# EAGLE design Badge_V3 (EAGLE 8.7.1)
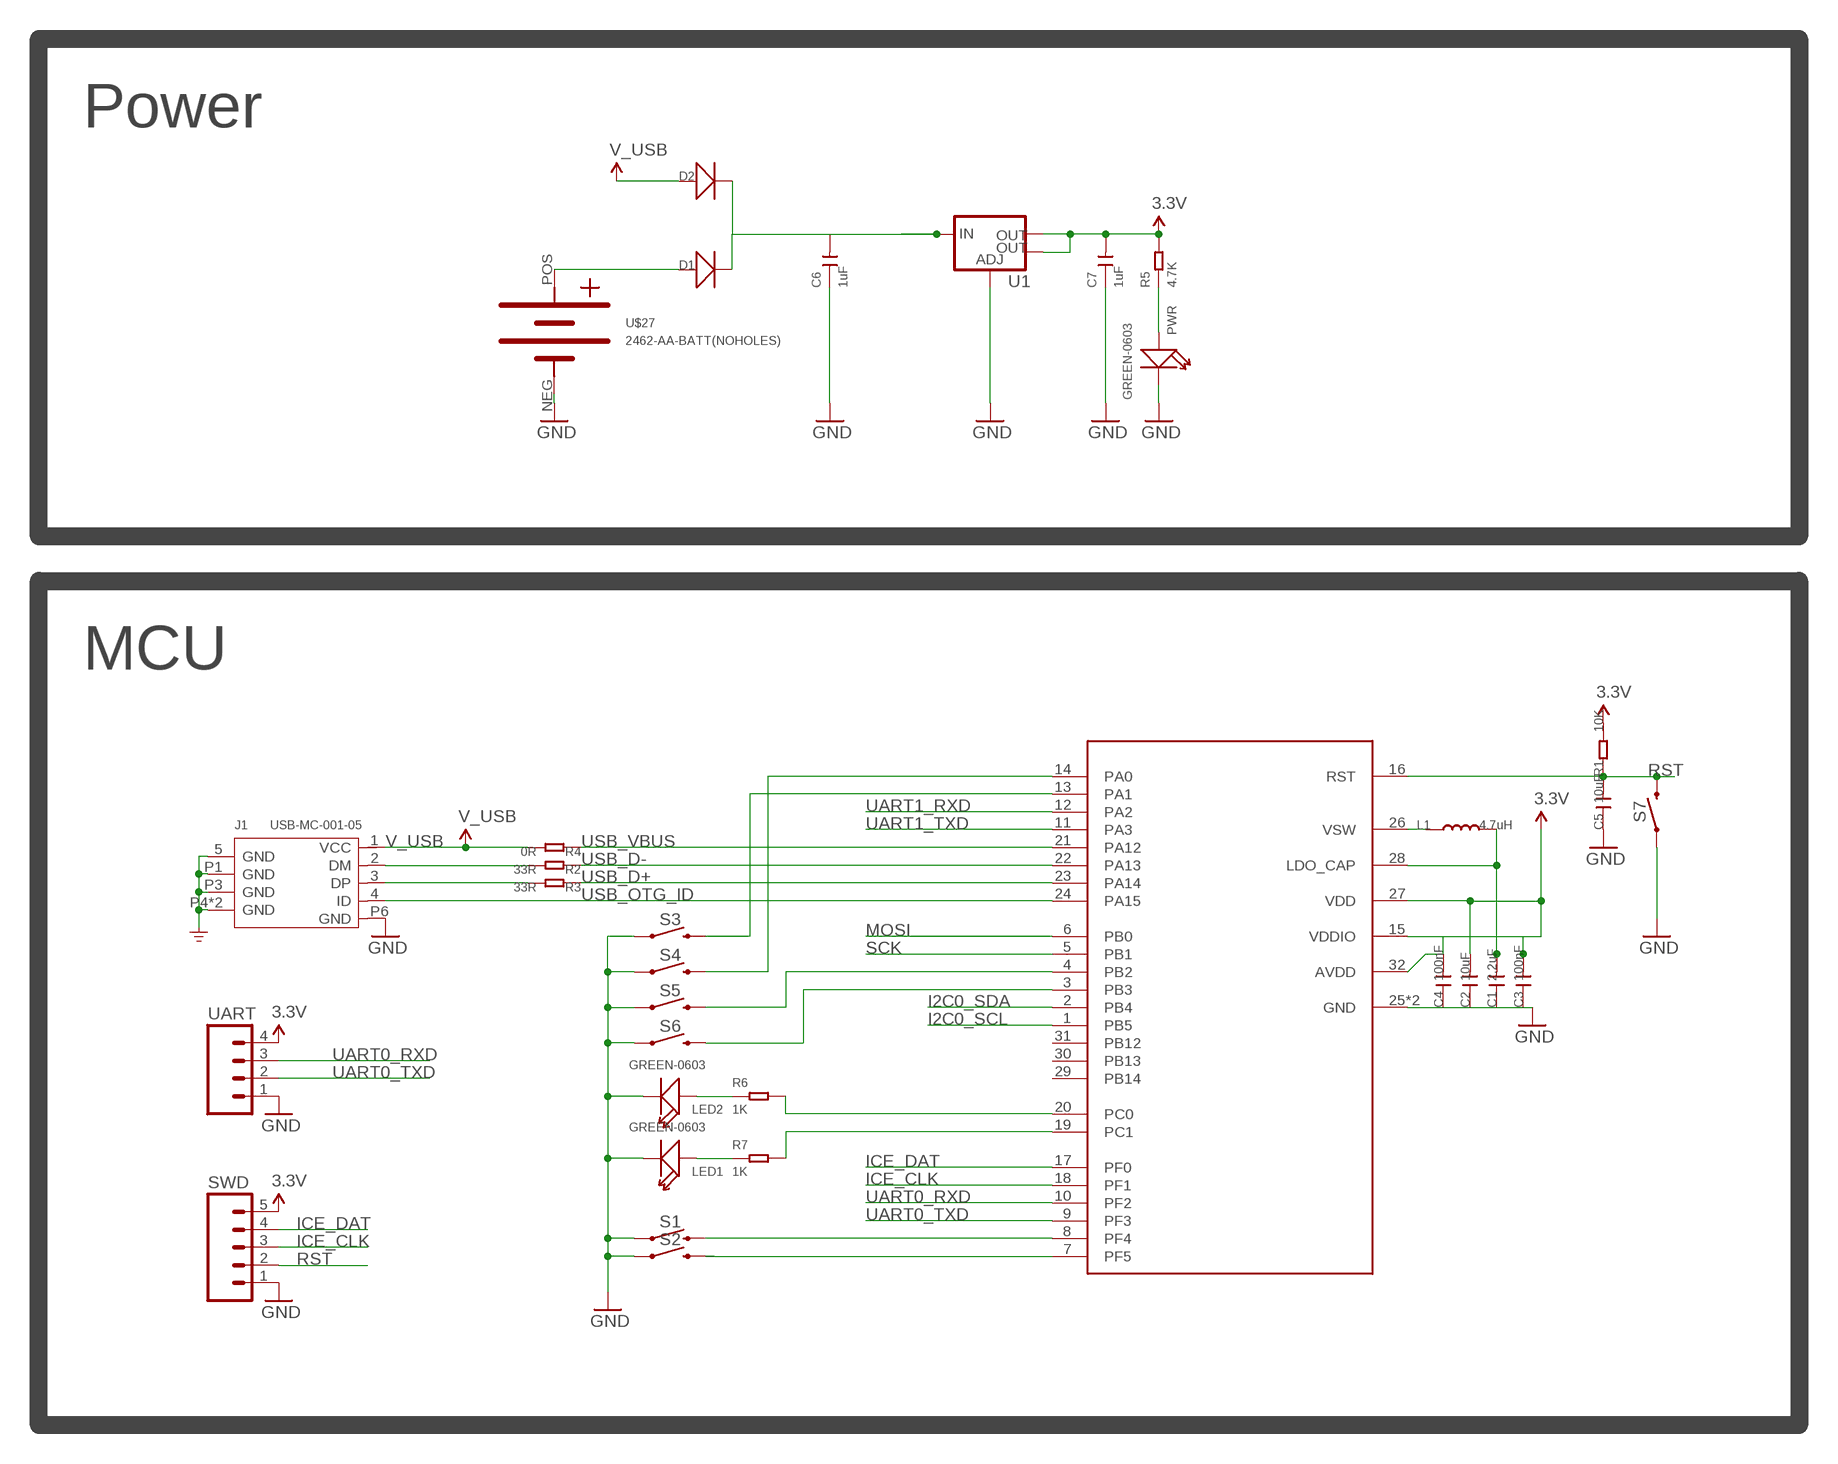
[diagram p0: schematic, sheet 1, part 1 of 2]
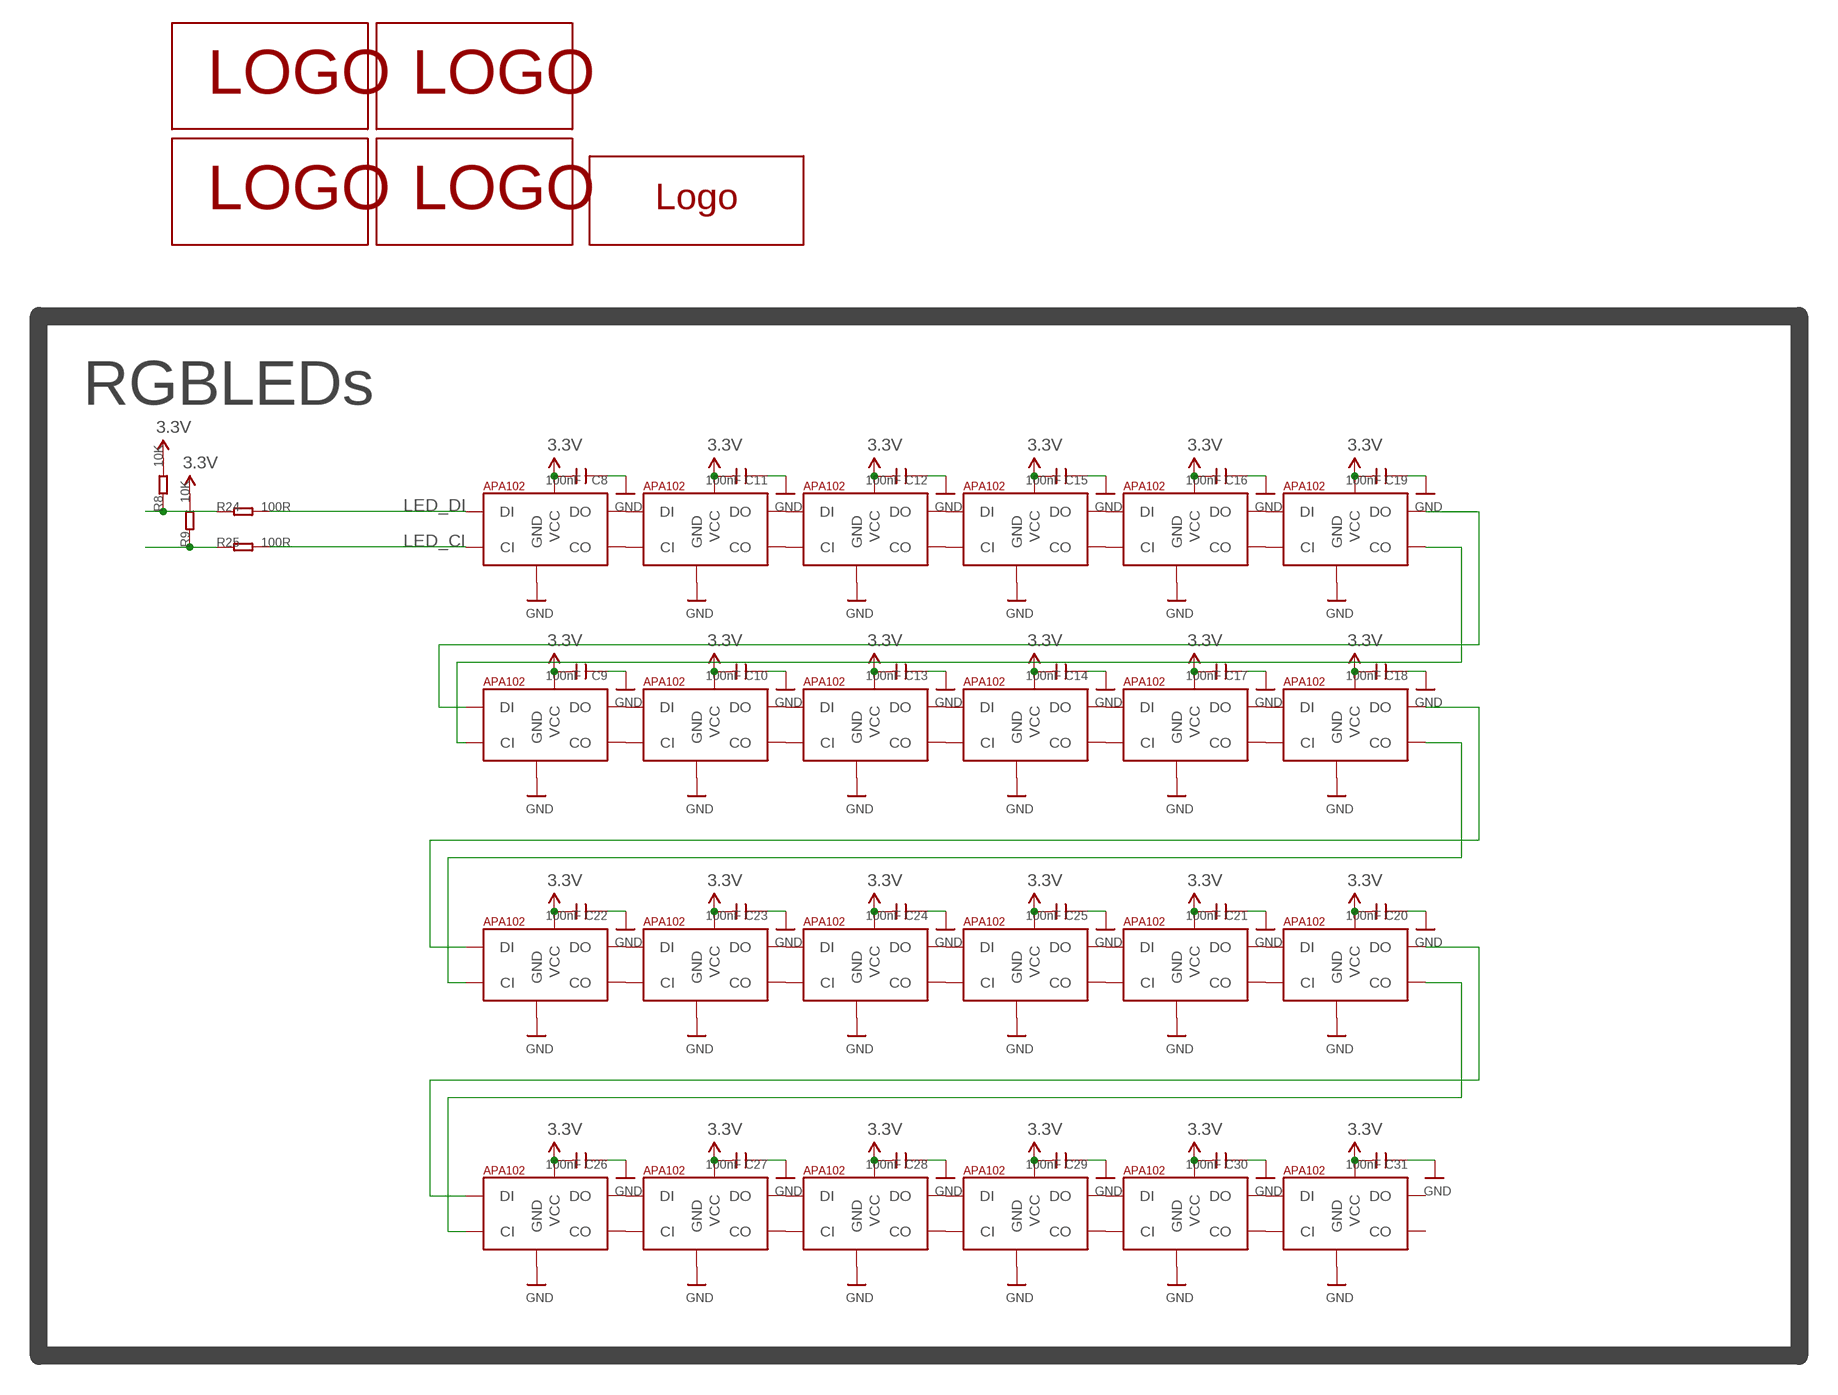
[diagram p1: schematic, sheet 1, part 2 of 2]

## Parts
C1  2.2uF  C-0402  [C0402@1]
C2  10uF  C-0402  [C0402@1]
C3  100nF  C-0603  [C0603@1]
C4  100nF  C-0402  [C0402@1]
C5  10uF  C-0402  [C0402@1]
C6  1uF  CAP-0603  [C0603]
C7  1uF  CAP-0603  [C0603]
C8  100nF  C-0402  [C0402@1]
C9  100nF  C-0402  [C0402@1]
C10  100nF  C-0402  [C0402@1]
C11  100nF  C-0402  [C0402@1]
C12  100nF  C-0402  [C0402@1]
C13  100nF  C-0402  [C0402@1]
C14  100nF  C-0402  [C0402@1]
C15  100nF  C-0402  [C0402@1]
C16  100nF  C-0402  [C0402@1]
C17  100nF  C-0402  [C0402@1]
C18  100nF  C-0402  [C0402@1]
C19  100nF  C-0402  [C0402@1]
C20  100nF  C-0402  [C0402@1]
C21  100nF  C-0402  [C0402@1]
C22  100nF  C-0402  [C0402@1]
C23  100nF  C-0402  [C0402@1]
C24  100nF  C-0402  [C0402@1]
C25  100nF  C-0402  [C0402@1]
C26  100nF  C-0402  [C0402@1]
C27  100nF  C-0402  [C0402@1]
C28  100nF  C-0402  [C0402@1]
C29  100nF  C-0402  [C0402@1]
C30  100nF  C-0402  [C0402@1]
C31  100nF  C-0402  [C0402@1]
D1  D'1206'  [SOD123]
D2  D'1206'  [SOD123]
J1  USB-MC-001-05  MICRO-USB5+4P  [MICRO-USB5+5P-SMD-0.65-7.2X5.06MM]
L1  4.7uH  L'0603'  [L0603]
LED1  GREEN-0603  SMD-LED-CLEAR-GREEN(0603)  [LED-0603]
LED2  GREEN-0603  SMD-LED-CLEAR-GREEN(0603)  [LED-0603]
PWR  GREEN-0603  SMD-LED-CLEAR-GREEN(0603)  [LED-0603]
R1  10K  R-0402  [R0402]
R2  33R  R-0402  [R0402]
R3  33R  R-0402  [R0402]
R4  0R  R-0402  [R0402]
R5  4.7K  RES-0402  [R0402]
R6  1K  RES-0402  [R0402]
R7  1K  RES-0402  [R0402]
R8  10K  R-0402  [R0402]
R9  10K  R-0402  [R0402]
R24  100R  R-0402  [R0402]
R25  100R  R-0402  [R0402]
S1  MOMENTARY-SWITCH-SPST-SMD-6.2MM-TALL  [TACTILE_SWITCH_SMD_6.2MM_TALL]
S2  MOMENTARY-SWITCH-SPST-SMD-6.2MM-TALL  [TACTILE_SWITCH_SMD_6.2MM_TALL]
S3  MOMENTARY-SWITCH-SPST-SMD-6.2MM-TALL  [TACTILE_SWITCH_SMD_6.2MM_TALL]
S4  MOMENTARY-SWITCH-SPST-SMD-6.2MM-TALL  [TACTILE_SWITCH_SMD_6.2MM_TALL]
S5  MOMENTARY-SWITCH-SPST-SMD-6.2MM-TALL  [TACTILE_SWITCH_SMD_6.2MM_TALL]
S6  MOMENTARY-SWITCH-SPST-SMD-6.2MM-TALL  [TACTILE_SWITCH_SMD_6.2MM_TALL]
S7  MOMENTARY-SWITCH-SPST-SMD-6.2MM-TALL  [TACTILE_SWITCH_SMD_6.2MM_TALL]
SWD  M05LOCK  [1X05_LOCK]
U1  V_REG_LM1117SOT223  [SOT223]
U$1  M2351  [QFN-32]
U$2  APA1022020  [APA102_2020]
U$4  APA1022020  [APA102_2020]
U$5  APA1022020  [APA102_2020]
U$6  APA1022020  [APA102_2020]
U$7  APA1022020  [APA102_2020]
U$8  APA1022020  [APA102_2020]
U$9  APA1022020  [APA102_2020]
U$10  APA1022020  [APA102_2020]
U$11  APA1022020  [APA102_2020]
U$12  APA1022020  [APA102_2020]
U$13  APA1022020  [APA102_2020]
U$14  APA1022020  [APA102_2020]
U$15  APA1022020  [APA102_2020]
U$16  APA1022020  [APA102_2020]
U$17  APA1022020  [APA102_2020]
U$18  APA1022020  [APA102_2020]
U$19  APA1022020  [APA102_2020]
U$20  APA1022020  [APA102_2020]
U$21  APA1022020  [APA102_2020]
U$22  APA1022020  [APA102_2020]
U$23  APA1022020  [APA102_2020]
U$24  APA1022020  [APA102_2020]
U$25  APA1022020  [APA102_2020]
U$26  TAIWANSILK_FILL  [TAIWAN_SILK_FILL]
U$27  2462-AA-BATT(NOHOLES)  [2462-AA-BATT-NOHOLES]
U$28  HITCON_LOGOGOLD_LARGE  [HITCON_LOGO_BIGGER_GOLD]
U$30  TAIWANKIM  [TAIWAN_SILK_FILL_2]
U$31  TAIWANMAZ  [TAIWAN_SILK_FILL_4]
U$33  APA1022020  [APA102_2020]
U$34  TAIWANPUN  [TAIWAN_SILK_FILL_3]
UART  M04LOCK  [1X04_LOCK]

## Nets
3.3V: C2.2 C3.2 C4.2 C7.2 C8.2 C9.2 C10.2 C11.2 C12.2 C13.2 C14.2 C15.2 C16.2 C17.2 C18.2 C19.2 C20.2 C21.2 C22.2 C23.2 C24.2 C25.2 C26.2 C27.2 C28.2 C29.2 C30.2 C31.2 R1.2 R5.2 R8.2 R9.2 SWD.5 U1.2(OUT) U1.4(OUT) U$1.15(VDDIO) U$1.27(VDD) U$1.32(AVDD) U$2.V_CC(VCC) U$4.V_CC(VCC) U$5.V_CC(VCC) U$6.V_CC(VCC) U$7.V_CC(VCC) U$8.V_CC(VCC) U$9.V_CC(VCC) U$10.V_CC(VCC) U$11.V_CC(VCC) U$12.V_CC(VCC) U$13.V_CC(VCC) U$14.V_CC(VCC) U$15.V_CC(VCC) U$16.V_CC(VCC) U$17.V_CC(VCC) U$18.V_CC(VCC) U$19.V_CC(VCC) U$20.V_CC(VCC) U$21.V_CC(VCC) U$22.V_CC(VCC) U$23.V_CC(VCC) U$24.V_CC(VCC) U$25.V_CC(VCC) U$33.V_CC(VCC) UART.4
GND: C1.1 C2.1 C3.1 C4.1 C5.1 C6.1 C7.1 C8.1 C9.1 C10.1 C11.1 C12.1 C13.1 C14.1 C15.1 C16.1 C17.1 C18.1 C19.1 C20.1 C21.1 C22.1 C23.1 C24.1 C25.1 C26.1 C27.1 C28.1 C29.1 C30.1 C31.1 J1.5(GND) J1.P1(GND) J1.P3(GND) J1.P4(GND) J1.P5(GND) J1.P6(GND) LED1.- LED2.- PWR.- S1.A2 S2.A2 S3.A2 S4.A2 S5.A2 S6.A2 S7.A2 SWD.1 U1.1(ADJ) U$1.25(GND) U$1.EP(GND) U$2.GND U$4.GND U$5.GND U$6.GND U$7.GND U$8.GND U$9.GND U$10.GND U$11.GND U$12.GND U$13.GND U$14.GND U$15.GND U$16.GND U$17.GND U$18.GND U$19.GND U$20.GND U$21.GND U$22.GND U$23.GND U$24.GND U$25.GND U$27.NEG U$33.GND UART.1 ; supply symbol labelled GND_POWER
I2C0_SCL: U$1.1(PB5)
I2C0_SDA: U$1.2(PB4)
ICE_CLK: SWD.3 U$1.18(PF1)
ICE_DAT: SWD.4 U$1.17(PF0)
LED_CI: R25.2 U$33.C_IN(CI)
LED_DI: R24.2 U$33.D_IN(DI)
MOSI: R8.1 R24.1 U$1.6(PB0)
N$1: L1.1 U$1.26(VSW)
N$2: C1.2 L1.2 U$1.28(LDO_CAP)
N$3: J1.2(DM) R2.2
N$4: J1.3(DP) R3.2
N$5: R6.2 U$1.20(PC0)
N$6: C6.2 D1.- D2.- U1.3(IN)
N$7: PWR.+ R5.1
N$8: D1.+ U$27.POS
N$9: S1.B2 U$1.8(PF4)
N$10: S2.B2 U$1.7(PF5)
N$11: S4.B2 U$1.14(PA0)
N$12: LED2.+ R6.1
N$13: LED1.+ R7.1
N$14: R7.2 U$1.19(PC1)
N$15: S3.B2 U$1.13(PA1)
N$16: S5.B2 U$1.4(PB2)
N$18: S6.B2 U$1.3(PB3)
N$22: U$2.D_OUT(DO) U$4.D_IN(DI)
N$23: U$2.CL_OUT(CO) U$4.C_IN(CI)
N$24: U$4.CL_OUT(CO) U$5.C_IN(CI)
N$25: U$4.D_OUT(DO) U$5.D_IN(DI)
N$26: U$5.D_OUT(DO) U$6.D_IN(DI)
N$27: U$5.CL_OUT(CO) U$6.C_IN(CI)
N$28: U$6.CL_OUT(CO) U$7.C_IN(CI)
N$29: U$6.D_OUT(DO) U$7.D_IN(DI)
N$30: U$8.D_OUT(DO) U$9.D_IN(DI)
N$31: U$8.CL_OUT(CO) U$9.C_IN(CI)
N$32: U$9.CL_OUT(CO) U$10.C_IN(CI)
N$33: U$9.D_OUT(DO) U$10.D_IN(DI)
N$34: U$10.D_OUT(DO) U$11.D_IN(DI)
N$35: U$10.CL_OUT(CO) U$11.C_IN(CI)
N$36: U$11.CL_OUT(CO) U$12.C_IN(CI)
N$37: U$11.D_OUT(DO) U$12.D_IN(DI)
N$38: U$12.D_OUT(DO) U$13.D_IN(DI)
N$39: U$12.CL_OUT(CO) U$13.C_IN(CI)
N$40: U$14.CL_OUT(CO) U$15.C_IN(CI)
N$41: U$14.D_OUT(DO) U$15.D_IN(DI)
N$42: U$15.D_OUT(DO) U$16.D_IN(DI)
N$43: U$15.CL_OUT(CO) U$16.C_IN(CI)
N$44: U$16.CL_OUT(CO) U$17.C_IN(CI)
N$45: U$16.D_OUT(DO) U$17.D_IN(DI)
N$46: U$17.D_OUT(DO) U$18.D_IN(DI)
N$47: U$17.CL_OUT(CO) U$18.C_IN(CI)
N$48: U$18.CL_OUT(CO) U$19.C_IN(CI)
N$49: U$18.D_OUT(DO) U$19.D_IN(DI)
N$50: U$2.C_IN(CI) U$33.CL_OUT(CO)
N$51: U$2.D_IN(DI) U$33.D_OUT(DO)
N$52: U$20.D_OUT(DO) U$21.D_IN(DI)
N$53: U$20.CL_OUT(CO) U$21.C_IN(CI)
N$66: U$21.D_OUT(DO) U$22.D_IN(DI)
N$67: U$21.CL_OUT(CO) U$22.C_IN(CI)
N$80: U$22.D_OUT(DO) U$23.D_IN(DI)
N$81: U$22.CL_OUT(CO) U$23.C_IN(CI)
N$94: U$23.D_OUT(DO) U$24.D_IN(DI)
N$95: U$23.CL_OUT(CO) U$24.C_IN(CI)
N$108: U$24.D_OUT(DO) U$25.D_IN(DI)
N$109: U$24.CL_OUT(CO) U$25.C_IN(CI)
N$122: U$7.D_OUT(DO) U$8.D_IN(DI)
N$123: U$7.CL_OUT(CO) U$8.C_IN(CI)
N$124: U$13.D_OUT(DO) U$14.D_IN(DI)
N$125: U$13.CL_OUT(CO) U$14.C_IN(CI)
N$126: U$19.D_OUT(DO) U$20.D_IN(DI)
N$127: U$19.CL_OUT(CO) U$20.C_IN(CI)
RST: C5.2 R1.1 S7.B2 SWD.2 U$1.16(RST)
SCK: R9.1 R25.1 U$1.5(PB1)
UART0_RXD: U$1.10(PF2) UART.3
UART0_TXD: U$1.9(PF3) UART.2
UART1_RXD: U$1.12(PA2)
UART1_TXD: U$1.11(PA3)
USB_D+: R3.1 U$1.23(PA14)
USB_D-: R2.1 U$1.22(PA13)
USB_OTG_ID: J1.4(ID) U$1.24(PA15)
USB_VBUS: R4.1 U$1.21(PA12)
V_USB: D2.+ J1.1(VCC) R4.2
Unconnected: U$1.29(PB14) U$1.30(PB13) U$1.31(PB12) U$25.CL_OUT(CO) U$25.D_OUT(DO)

## Notes on the sheet
- Power
- RGBLEDs
- MCU

## Library data of the parts
C1-C5 C8-C31 = Discrete:C*: Ceramic Capacitors
C6 C7 = Discrete:CAP: Ceramic Capacitors
D1 D2 = Discrete:D*
J1 = Connector-new:MICRO-USB5+4P: 5+4P-SMD-0.65-B:320010000;5+2P-SMD-0.65-AB:340032001;5+5P-SMD-0.65-7.2X5.06MM:320010050;
L1 = Discrete:L*
LED1 LED2 PWR = Seeed-OPL-Diode:SMD-LED-CLEAR-GREEN(0603): 304090043; MPN: 19-217-G7C-AN1P2-3T
R1-R4 R8 R9 R24 R25 = Discrete:R*
R5-R7 = Seeed-OPL-Resistor:RES
S1-S7 = SparkFun-Switches:MOMENTARY-SWITCH-SPST: Momentary Switch (Pushbutton) - SPST Normally-open (NO) SPST momentary switches (buttons, pushbuttons). Variants PTH-12MM - 12mm square, through-hole Momentary Pushbutton Switch - 12mm Square <https://www.sparkfun.com/products/9190> (COM-09190) PTH-6.0MM, PTH-6.0MM-KIT - 6.0mm square, through-hole Mini Pushbutton Switch <https://www.sparkfun.com/products/97> (COM-00097) KIT package intended for soldering kit's - only one side of pads' copper is exposed. PTH-RIGHT-ANGLE-KIT - Right-angle, through-hole Right Angle Tactile Button <https://www.sparkfun.com/products/10791> - Used on SparkFun BigTime Watch Kit <https://www.sparkfun.com/products/11734> SMD-12MM - 12mm square, surface-mount Tactile Button - SMD (12mm) <https://www.sparkfun.com/products/12993> (COM-12993) Used on SparkFun PicoBoard <https://www.sparkfun.com/products/11888> SMD-4.5MM - 4.5mm Square Trackball Switch Used on SparkFun Blackberry Trackballer Breakout <https://www.sparkfun.com/products/13169> SMD-4.6MMX2.8MM - 4.60mm x 2.80mm, surface mount Used on SparkFun SAMD21 Mini Breakout <https://www.sparkfun.com/products/13664> SMD-5.2MM, SMD-5.2-REDUNDANT - 5.2mm square, surface-mount Mini Pushbutton Switch - SMD <https://www.sparkfun.com/products/8720> (COM-08720) Used on Arduino Pro Mini <https://www.sparkfun.com/products/11114> REDUNDANT package connects both switch circuits together SMD-6.0X3.5MM - 6.0 x 3.5mm, surface mount Momentary Reset Switch SMD <https://www.sparkfun.com/products/8229> (COM-08229) SMD-6.2MM-TALL - 6.2mm square, surface mount Tactile Button - SMD (6mm) <https://www.sparkfun.com/products/12992> Used on SparkFun Digital Sandbox <https://www.sparkfun.com/products/12651> SMD-RIGHT-ANGLE - Right-angle, surface mount Used on SparkFun Block for Intel® Edison - Arduino <https://www.sparkfun.com/products/13036>; PROD_ID: SWCH-11966; SF_SKU: COM-12992
SWD = SparkFun-Connectors:M05: Header 5 Standard 5-pin 0.1" header. Use with straight break away headers (SKU : PRT-00116), right angle break away headers (PRT-00553), swiss pins (PRT-00743), machine pins (PRT-00117), and female headers (PRT-00115). Molex polarized connector foot print use with SKU : PRT-08230 with associated crimp pins and housings.
U1 = SparkFun-IC-Power:V_REG_LM1117: Voltage Regulator LM1117 Standard adjustable voltage regulator but in SMD form. Spark Fun Electronics SKU : COM-00595; PROD_ID: VREG-08170
U$1 = SparkFun-IC-Microcontroller:M2351
U$2 U$4-U$25 U$33 = jos-ph:APA102: APA102C 5050 RGB LED -- Adafruit DotStar Single LED Pixel Product Page: https://www.adafruit.com/products/2343 Datasheet: https://cdn-shop.adafruit.com/product-files/2343/APA102C.pdf
U$26 U$30 U$31 U$34 = logo:TAIWAN
U$27 = 2462-AA-BATT:2462-AA-BATT
U$28 = logo:HITCON_LOGO
UART = SparkFun-Connectors:M04: Header 4 Standard 4-pin 0.1" header. Use with straight break away headers (SKU : PRT-00116), right angle break away headers (PRT-00553), swiss pins (PRT-00743), machine pins (PRT-00117), and female headers (PRT-00115). Molex polarized connector foot print use with SKU : PRT-08231 with associated crimp pins and housings. 1MM SMD Version SKU: PRT-10208; PROD_ID: CONN-09696

## Net classes
0 default: width 0.254 mm

## Board
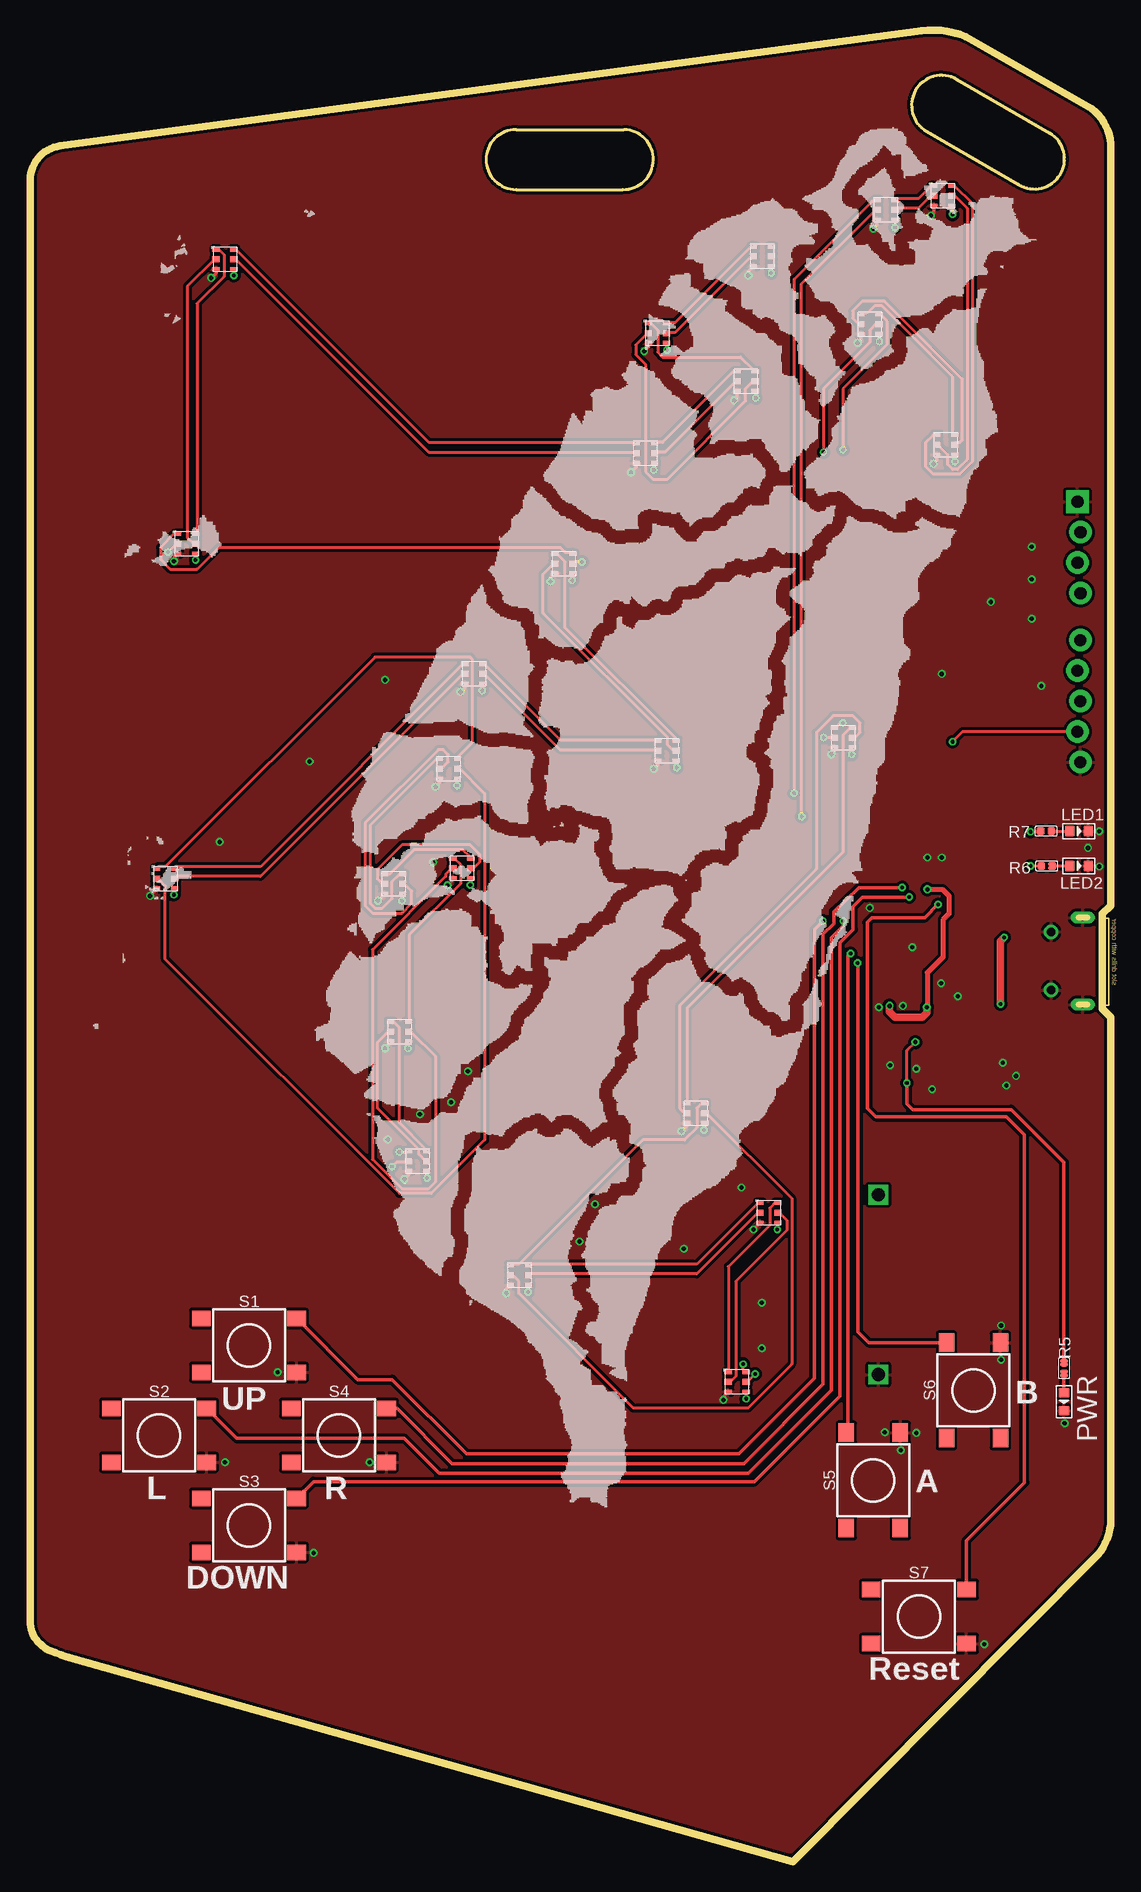
[diagram p2: board, top side]
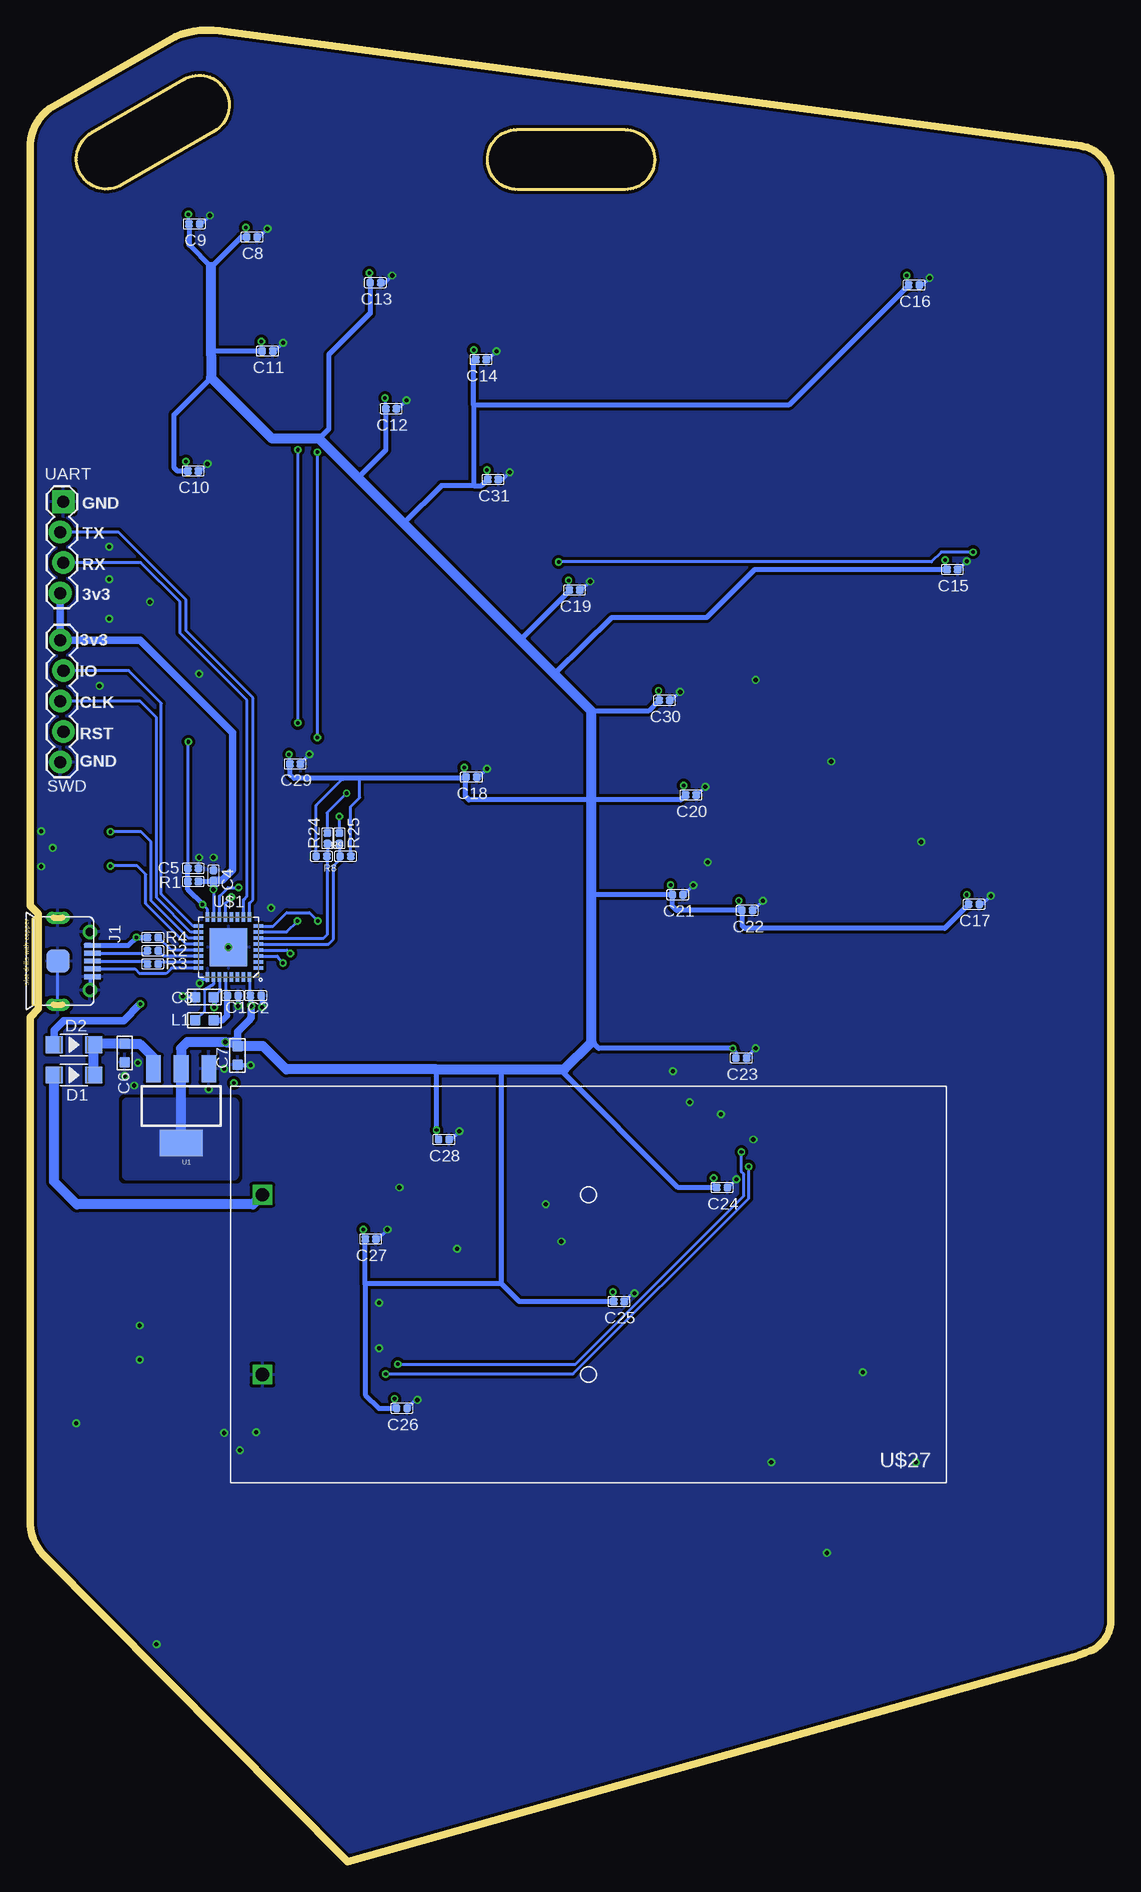
[diagram p3: board, bottom side, seen from below]

Size 90.11 x 152.66 mm. Coordinates in mm from the lower left corner, seen from the top.
Outline: 0.01,139.9 0.01,20.1 arc68 1.71,17.6 arc1 3.01,17.1 63.61,0 89.01,25.6 arc42 90.11,28.5 90.11,70.4 89.41,71.1 89.41,79 90.11,79.7 90.11,142.8 arc53 88.51,146.1 78.01,152.1 arc31 74.31,152.6 2.51,143 arc86 0.01,139.9
Outline: 40.52,144.37 49.52,144.37 arc-180 49.42,139.37 40.52,139.37 arc-180 40.52,144.37
Outline: 77.25,148.55 85.04,144.05 arc-180 82.45,139.77 74.75,144.22 arc-180 77.25,148.55
Copper layers (1*16): Top 0.035mm / dielectric 1.5mm / Bottom 0.035mm
Design rules "SeeedStudio_2layer_DRU_no_angle_20140221 *": minimum track width 6mil, minimum drill 0.3mm, track to track 6mil, track to pad 6mil, pad to pad 6mil, via to via 6mil, smd to smd 0mil, copper to edge 10mil, drill to drill 10mil, minimum pad ring 10mil, minimum via ring 6mil, stop-mask expansion 2mil, vias tented up to drill 100mil, thermal gap 10mil

### Footprints (pad centres in the part's own frame; a part is rotated, then mirrored left to right if it is on the bottom)
C0402@1 = smd 0.635 x 0.635: 1 -0.445,0; 2 0.445,0
C0603@1 = smd 0.889 x 0.889: 1 -0.762,0; 2 0.762,0
C0603 = smd 0.889 x 0.889: 1 -0.762,0; 2 0.762,0
SOD123 = smd 1.397 x 1.397: + -1.651,0; - 1.651,0
MICRO-USB5+5P-SMD-0.65-7.2X5.06MM = smd 0.4 x 1.35: 1 -1.3,2.875; 2 -0.65,2.875; 3 0,2.875; 4 0.65,2.875; 5 1.3,2.875 | smd 1.9 x 1.9: P1 0,0 | drill 0.508 pad 1.016 long: P3 -3.625,0; P4 3.625,0 | drill 0.7: P5 -2.425,2.65; P6 2.425,2.65
L0603 = smd 0.889 x 0.889: 1 -0.762,0; 2 0.762,0
LED-0603 = smd 0.762 x 0.889: + -0.762,0; - 0.762,0
R0402 = smd 0.635 x 0.635: 1 -0.445,0; 2 0.445,0
R0402' = smd 0.635 x 0.635: 1 0,0.445; 2 0,-0.445
TACTILE_SWITCH_SMD_6.2MM_TALL = smd 1.55 x 1.3: A1 -3.975,-2.25; A2 3.975,-2.25; B1 -3.975,2.25; B2 3.975,2.25
1X05_LOCK = drill 1.016 pad 1.88: 1 0,0.127; 2 2.54,-0.127; 3 5.08,0.127; 4 7.62,-0.127; 5 10.16,0.127
SOT223 = smd 1.219 x 2.235: 1 -2.311,-3.099; 2 0,-3.099; 3 2.311,-3.099 | smd 3.6 x 2.2: 4 0,3.099
QFN-32 = smd 0.285 x 0.8: 1 -1.75,-2.5; 2 -1.25,-2.5; 3 -0.75,-2.5; 4 -0.25,-2.5; 5 0.25,-2.5; 6 0.75,-2.5; 7 1.25,-2.5; 8 1.75,-2.5; 17 1.75,2.5; 18 1.25,2.5; 19 0.75,2.5; 20 0.25,2.5; 21 -0.25,2.5; 22 -0.75,2.5; 23 -1.25,2.5; 24 -1.75,2.5 | smd 0.8 x 0.285: 9 2.5,-1.75; 10 2.5,-1.25; 11 2.5,-0.75; 12 2.5,-0.25; 13 2.5,0.25; 14 2.5,0.75; 15 2.5,1.25; 16 2.5,1.75; 25 -2.5,1.75; 26 -2.5,1.25; 27 -2.5,0.75; 28 -2.5,0.25; 29 -2.5,-0.25; 30 -2.5,-0.75; 31 -2.5,-1.25; 32 -2.5,-1.75 | smd 3.15 x 3.15: EP 0,0
APA102_2020 = smd 0.6 x 0.5: C_IN -0.75,0; CL_OUT 0.75,0 | smd 0.6 x 0.35: D_IN -0.75,0.825; D_OUT 0.75,0.825; GND -0.75,-0.825; V_CC 0.75,-0.825
2462-AA-BATT-NOHOLES = drill 1.1 square: NEG 57.023,-9.017; POS 57.023,-24.003
1X04_LOCK = drill 1.016 pad 1.88 square: 1 0,0.127 | drill 1.016 pad 1.88: 2 2.54,-0.127; 3 5.08,0.127; 4 7.62,-0.127

### Placement (x,y rotation side)
C1  73.19,72.19 180 bottom
C2  71.28,72.19 180 bottom
C3  75.55,72.07 0 bottom
C4  74.81,82.2 270 bottom
C5  76.51,82.8 180 bottom
C6  82.21,67.4 90 bottom
C7  72.81,67.2 90 bottom
C8  71.61,135.4 180 bottom
C9  76.41,136.5 180 bottom
C10  76.51,115.9 180 bottom
C11  70.31,125.9 180 bottom
C12  60.01,121.1 180 bottom
C13  61.31,131.6 180 bottom
C14  52.51,125.2 180 bottom
C15  13.21,107.7 180 bottom
C16  16.41,131.4 180 bottom
C17  11.41,79.8 180 bottom
C18  53.31,90.4 180 bottom
C19  44.71,106 180 bottom
C20  35.01,88.9 180 bottom
C21  36.11,80.6 180 bottom
C22  30.31,79.3 180 bottom
C23  30.81,67 180 bottom
C24  32.41,56.2 180 bottom
C25  41.01,46.7 180 bottom
C26  59.11,37.8 180 bottom
C27  61.71,51.9 180 bottom
C28  55.61,60.2 180 bottom
C29  68.01,91.5 180 bottom
C30  37.21,96.8 180 bottom
C31  51.51,115.2 180 bottom
D1  86.44,65.57 0 bottom
D2  86.44,68.09 0 bottom
J1  87.78,75.07 270 bottom
L1  75.56,70.13 0 bottom
LED1  87.46,85.9 0 top
LED2  87.46,83 0 top
PWR  86.21,38.35 270 top
R1  76.51,81.7 0 bottom
R2  79.86,75.93 180 bottom
R3  79.86,74.83 180 bottom
R4  79.86,77.03 180 bottom
R5  4.7K  [R0402']  86.21,41.15 180 top
R6  1K  [R0402']  84.76,83 270 top
R7  1K  [R0402']  84.71,85.9 270 top
R8  65.81,83.8 180 bottom
R9  63.81,83.8 0 bottom
R24  65.31,85.3 90 bottom
R25  64.31,85.3 90 bottom
S1  18.26,43.05 0 top
S2  10.76,35.55 0 top
S3  18.26,28.05 0 top
S4  25.76,35.55 0 top
S5  70.31,31.8 90 top
S6  78.66,39.3 90 top
S7  74.11,20.45 0 top
SWD  87.45,91.65 90 bottom
U1  77.51,63 180 bottom
U$1  73.56,76.23 90 bottom
U$2  76.1,138.84 0 top
U$4  76.36,118.1 0 top
U$5  70.03,128.16 0 top
U$6  67.81,93.7 0 top
U$7  55.51,62.4 0 top
U$8  40.81,48.9 0 top
U$9  61.61,54.1 0 top
U$10  58.96,40 0 top
U$11  32.31,58.4 0 top
U$12  30.81,69.2 0 top
U$13  36.01,82.8 0 top
U$14  30.31,81.5 0 top
U$15  34.91,91.1 0 top
U$16  11.31,81.95 0 top
U$17  37.01,99 0 top
U$18  53.11,92.6 0 top
U$19  44.51,108.2 0 top
U$20  13.06,109.85 0 top
U$21  16.26,133.55 0 top
U$22  51.31,117.4 0 top
U$23  59.71,123.4 0 top
U$24  52.31,127.4 0 top
U$25  61.06,133.8 0 top
U$26  -2.04,23.05 0 top
U$27  13.71,31.6 180 bottom
U$28  29.92,10.09 345 top
U$30  4.36,103.6 0 top
U$31  8.56,126.7 0 top
U$33  71.37,137.67 0 top
U$34  2.16,65.15 0 top
UART  87.46,113.35 270 bottom

### Tracks (layer width: path | path; a pad name or v marks a point on that pad's centre or on a via)
3.3V  (via drill 0.3, 0.35)
  Top 0.254: 74.69,81.16 v74.81,81.04 74.69,81.1 | 87.49,105.75 UART.4 | U$2.V_CC 76.85,137.36 v76.91,137.3 | U$33.V_CC 72.12,136.21 v72.11,136.2 | U$25.V_CC v61.81,132.4 | U$5.V_CC 70.78,126.72 v70.81,126.7 | U$4.V_CC v77.11,116.7 | U$23.V_CC 60.46,122.05 v60.51,122 | U$24.V_CC 53.06,126.05 v53.11,126 | U$22.V_CC 52.06,116.05 v52.01,116 | U$21.V_CC v17.01,132.2 | U$20.V_CC v13.81,108.5 | U$19.V_CC 45.26,106.85 v45.21,106.8 | U$17.V_CC 37.76,97.65 v37.71,97.6 | U$6.V_CC 68.56,92.35 v68.51,92.3 | U$18.V_CC 53.86,91.25 v53.91,91.2 | U$15.V_CC 35.66,89.75 v35.61,89.7 | U$13.V_CC 36.76,81.45 v36.71,81.4 | U$14.V_CC 31.06,80.15 v31.01,80.1 | U$16.V_CC 12.06,80.65 v12.01,80.6 | U$12.V_CC 31.51,68.33 v31.51,67.8 | U$7.V_CC 56.26,61.05 v56.21,61 | U$11.V_CC 33.06,57.05 v33.11,57 | U$9.V_CC 62.36,52.75 v62.31,52.7 | U$10.V_CC v59.71,38.6 | U$8.V_CC 41.51,48.03 v41.51,47.5 | v73.11,64.9 73.11,67.62 v73.81,68.32
  Top 0.305: v73.11,64.9 73.11,63.2 73.61,62.7 81.81,62.7 86.21,58.3 R5.2
  Top 0.406: v74.81,81.04 76.06,81.04 76.61,80.5 76.61,79 76.11,78.5 76.11,75.4 74.81,74.1 74.81,71.28 v74.76,71.23
  Top 0.61: v74.76,71.23 74.76,70.76 74.41,70.4 72.11,70.4 71.66,70.84 v71.66,71.33
  Bottom 0.254: U$1.32 71.81,72.28 C2.2 | U$1.27 74.31,72.55 C3.2 | 71.66,70.03 71.75,69.99 71.84,69.98 71.93,70.07 | U$1.15 | v74.81,81.04 U$1.15 | 72.74,67.92 C7.2 | v76.91,137.3 76.91,136.66 C9.2 | v72.11,136.2 72.11,135.54 C8.2 | v61.81,132.4 61.75,132.34 C13.2 | v70.81,126.7 70.81,125.76 C11.2 | v77.11,116.7 77.11,115.94 C10.2 | v60.51,122 60.51,121.06 C12.2 | v53.11,126 53.11,125.26 C14.2 | v52.01,116 52.01,115.16 C31.2 | v17.01,132.2 17.01,131.46 C16.2 | v13.81,108.5 13.81,107.66 C15.2 | v45.21,106.8 45.21,105.84 C19.2 | v37.71,97.6 37.71,96.85 C30.2 | v68.51,92.3 68.51,91.34 C29.2 | v53.91,91.2 53.91,90.35 C18.2 | v35.61,89.7 35.61,88.85 C20.2 | v36.71,81.4 36.71,80.66 C21.2 | v31.01,80.1 31.01,79.56 C22.2 | v12.01,80.6 12.01,79.66 C17.2 | v31.51,67.8 31.25,67.54 C23.2 | v56.21,61 56.21,60.25 C28.2 | v33.11,57 33.11,56.45 C24.2 | v62.31,52.7 62.31,51.95 C27.2 | v59.71,38.6 59.71,37.95 C26.2 | v41.51,47.5 41.45,47.45 C25.2 | R8.2 66.25,88.06 64.01,90.3 | R9.2 63.36,87.94 62.61,88.7 62.61,90.3 | C7.2 72.77,68 | C7.2 72.81,67.99
  Bottom 0.305: 73.16,64.95 v73.11,64.9
  Bottom 0.406: v74.76,71.23 74.76,72.05 C3.2 | v71.66,71.33 71.66,72.13 C2.2 | C4.2 arc9 74.83,81.69 R1.2 | C9.2 76.85,134.74 75.01,132.9 72.51,135.4 C8.2 | C11.2 74.71,125.9 75.01,125.6 | C10.2 77.81,115.9 78.11,116.2 78.11,120.6 75.01,123.7 | C12.2 60.45,117.66 62.76,115.35 | C13.2 61.75,129.06 65.21,125.6 65.21,119.4 66.01,118.6 | 58.96,111.55 55.81,114.7 53.11,114.7 | C31.2 52.45,114.7 53.11,114.7 | 53.11,121.4 53.11,125.26 | 53.11,121.4 53.11,114.7 | 53.11,121.4 26.85,121.4 C16.2 | 45.21,105.84 49.15,101.9 49.31,101.9 | C30.2 38.55,95.9 43.31,95.9 | C29.2 68.45,90.64 68.11,90.3 64.01,90.3 62.61,90.3 53.85,90.3 | 53.85,90.3 C18.2 | 53.85,90.3 53.81,90.26 53.81,88.8 53.51,88.5 43.31,88.5 35.85,88.5 C20.2 | C15.2 29.71,107.7 33.71,103.7 41.61,103.7 46.31,99.1 46.41,99 | 43.31,80.3 43.01,80.6 C21.2 36.55,79.64 36.21,79.3 C22.2 30.75,78.04 30.51,77.8 13.85,77.8 C17.2 | v31.51,67.8 42.71,67.8 43.31,68.4 | C24.2 36.07,56.2 45.91,66.04 | C25.2 49.31,46.7 50.81,48.2 | 50.81,48.2 50.81,65.94 50.71,66.04 | 62.15,48.1 C27.2 | 62.15,48.1 62.15,38.95 61.01,37.8 59.86,37.8 59.71,37.95 | 62.15,48.1 62.05,48.2 50.81,48.2 | v56.21,61 56.21,66.04
  Bottom 0.508: 72.61,67.94 C7.2
  Bottom 0.61: v71.66,71.33 71.66,70.34 71.93,70.07 72.81,69.2 72.81,67.99 | UART.4 87.57,105.72 SWD.5 87.56,101.8 80.91,101.8 73.21,94.1 73.21,82.7 74.11,81.8 74.76,81.8 C4.2 v74.81,81.04 | C7.2 72.81,67.94
  Bottom 0.813: 75.01,132.9 75.01,125.6 75.01,123.7 69.91,118.6 66.01,118.6 62.76,115.35 58.96,111.55 49.31,101.9 46.41,99 43.31,95.9 43.31,88.5 43.31,80.3 43.31,68.4 43.31,68.3 45.57,66.04 45.91,66.04 50.71,66.04 56.21,66.04 68.75,66.04 70.71,68 72.77,68 | 72.81,67.99 73.14,68.32 v73.81,68.32 76.98,68.32 77.51,67.8 U1.2 U1.4
  pour Bottom (isolate 0.305, no thermals): 82.01,63.3 73.11,63.3 73.11,57.2 82.01,57.2
GND  (via drill 0.35)
  Top 0.305: U$2.GND 75.35,137.44 v75.11,137.2 | U$33.GND 70.62,136.41 v70.31,136.1 | U$5.GND 69.28,126.88 v69.01,126.6 | U$25.GND 59.91,132.57 v59.91,132.2 | U$23.GND 58.96,122.05 v58.71,121.8 | U$24.GND 51.56,126.25 v51.21,125.9 | U$4.GND 75.61,116.8 v75.31,116.5 | U$22.GND 50.56,116.25 v50.11,115.8 | U$21.GND 15.51,132.4 v15.11,132 | U$20.GND 12.01,108.72 v12.01,108.4 | U$19.GND 43.41,107.03 v43.41,106.7 | U$17.GND 36.26,97.85 v35.91,97.5 | U$6.GND 67.06,92.55 v66.81,92.3 | U$18.GND 52.36,91.45 v52.01,91.1 | U$15.GND 34.16,89.95 v33.81,89.6 | U$13.GND 35.26,81.85 v34.81,81.4 | U$14.GND 29.56,80.65 v29.01,80.1 | U$16.GND 10.56,81.05 v10.01,80.5 | U$12.GND 30.06,68.25 v29.61,67.8 | U$11.GND 31.56,57.25 v31.21,56.9 | U$9.GND 60.86,53.25 v60.31,52.7 | U$7.GND 54.76,61.35 v54.31,60.9 | U$8.GND 39.71,47.73 v39.71,47.4 | U$10.GND 57.81,38.78 v57.81,38.5
  Bottom 0.254: U$1.25 75.31,73.55 75.96,73.55 v75.96,73.23 | J1.5 85.05,73.72 85.05,72.8 J1.P6 | J1.P1 87.8,74.86 87.8,71.66 J1.P4
  Bottom 0.305: C9.1 75.81,136.5 v75.11,137.2 | C8.1 71.01,135.4 v70.31,136.1 | C11.1 69.71,125.9 v69.01,126.6 | C13.1 60.51,131.6 v59.91,132.2 | C12.1 59.41,121.1 v58.71,121.8 | C14.1 51.91,125.2 v51.21,125.9 | C10.1 75.91,115.9 v75.31,116.5 | C31.1 50.71,115.2 v50.11,115.8 | C16.1 15.71,131.4 v15.11,132 | C15.1 12.71,107.7 v12.01,108.4 | C19.1 44.11,106 v43.41,106.7 | C30.1 36.61,96.8 v35.91,97.5 | C29.1 67.56,91.54 v66.81,92.3 | C18.1 52.71,90.4 v52.01,91.1 | C20.1 34.51,88.9 v33.81,89.6 | C21.1 35.61,80.6 v34.81,81.4 | C22.1 29.81,79.3 v29.01,80.1 | C17.1 10.71,79.8 v10.01,80.5 | C23.1 30.36,67.04 v29.61,67.8 | C24.1 31.91,56.2 v31.21,56.9 | C27.1 61.11,51.9 v60.31,52.7 | C28.1 55.01,60.2 v54.31,60.9 | C25.1 39.86,47.4 v39.71,47.4 | C26.1 57.96,38.5 v57.81,38.5
  Bottom 0.406: C7.1 v71.71,66.4 | C3.1 77.3,72.07 v77.36,72.13 | C1.1 72.75,71.35 v72.76,71.33 | C2.1 70.76,72.12 v70.76,71.23 | C4.1 74.76,82.64
  other vias: 76.01,83.7 74.81,83.7 73.56,76.23 82.21,65.5 16.26,33.3 80.96,44.7 75.21,64.4 79.56,18.15 80.96,41.85 73.91,35.75 71.26,35.8 86.26,36.55 54.51,51.1 59.31,56.2 47.11,54.8 45.81,51.7 61.01,46.6 61.01,42.8 35.11,63.3 36.51,65.9 15.81,85 29.61,98.5 23.31,91.7 70.01,79.5 33.61,83.3 32.51,62.3 29.81,60.2 89.16,85.9 89.16,82.95 88.21,84.5 23.66,25.75 28.31,33.3 20.66,40.8 72.61,34.3 81.41,64.7 73.91,66.1 81.11,66.6 83.51,109.6 83.51,106.9 83.51,103.6 80.11,105 76.01,99 84.31,98
  pour Bottom (isolate 0.254, rank 2): -4.99,-3.25 95.11,-3.25 95.11,155.45 -4.99,155.45
  pour Top (isolate 0.254): -4.99,155.45 95.11,155.45 95.11,-3.25 -4.99,-3.25
ICE_CLK
  Bottom 0.254: 76.13,77.51 U$1.18 76.69,77.48 79.56,80.35 79.56,80.47 79.56,80.48 79.56,95.36 80.94,96.73 SWD.3
ICE_DAT
  Bottom 0.254: U$1.17 76.49,77.98 79.16,80.65 79.16,96.55 81.88,99.27 SWD.4
LED_CI  (via drill 0.3)
  Top 0.254: v64.33,87.13 64.33,131.5 70.42,137.59 U$33.C_IN
  Bottom 0.254: v64.33,87.13 64.33,85.76 R25.2
LED_DI  (via drill 0.3)
  Top 0.254: v63.72,89.05 63.72,131.91 70.22,138.41 70.42,138.41 U$33.D_IN
  Bottom 0.254: v63.72,89.05 65.34,87.43 65.34,85.78 R24.2
MOSI
  Bottom 0.254: U$1.6 65.62,76.98 65.31,77.3 65.31,83.74 R8.1 65.31,83.85 R24.1
N$1
  Bottom 0.203: 75.56,72.68 75.56,70.9
  Bottom 0.254: U$1.26 74.81,73.14 75.56,72.68 | 75.56,70.9 L1.1
N$2
  Bottom 0.254: U$1.28 73.81,72.37 C1.2
  Bottom 0.508: L1.2 74.06,70.13 73.66,70.53 73.66,72.17 C1.2
N$3
  Bottom 0.254: 80.44,75.8 R2.2 80.48,75.81 80.31,75.81 80.4,75.72 J1.2 84.83,75.77
N$4
  Bottom 0.254: 84.83,75.09 J1.3 80.63,75.07 80.47,74.91 80.35,74.91 80.47,74.83 R3.2
N$5  (via drill 0.3)
  Top 0.254: v83.41,83 R6.2
  Bottom 0.254: U$1.20 77.09,76.48 80.46,79.85 80.46,82.3 81.16,83 v83.41,83
N$6
  Bottom 0.813: D1.- D2.- 84.71,68.16 C6.2 80.97,68.16 79.81,67 U1.3
N$7
  Top 0.305: R5.1 PWR.+
N$8
  Bottom 0.813: U$27.POS 71.53,54.8 86.21,54.8 88.11,56.7 88.11,65.55 D1.+
N$9  (via drill 0.3)
  Top 0.305: S1.B2 27.33,40.2 30.21,40.2 36.41,34 59.11,34 65.41,40.3 65.41,77.7 v66.11,78.4
  Bottom 0.254: 71.04,77.96 U$1.8 69.82,77.98 68.71,79.1 66.81,79.1 v66.11,78.4
N$10  (via drill 0.3)
  Top 0.305: S2.B2 17.23,35.3 31.21,35.3 34.11,32.4 59.91,32.4 66.81,39.3 66.81,77 67.81,78 v67.81,78.4
  Bottom 0.254: U$1.7 71.05,77.5 68.71,77.5 v67.81,78.4
N$11  (via drill 0.3)
  Top 0.305: S4.B2 30.61,37.8 35.21,33.2 59.51,33.2 66.11,39.8 66.11,77.3 67.01,78.2 67.01,79.2 69.11,81.2 v72.71,81.2
  Bottom 0.254: U$1.14 74.31,80.49 73.61,81.2 v72.71,81.2
N$12
  Top 0.254: R6.1 LED2.+
N$13
  Top 0.254: R7.1 LED1.+
N$14  (via drill 0.3)
  Top 0.254: v83.41,85.85 83.46,85.9 R7.2
  Bottom 0.254: U$1.19 76.89,76.98 80.01,80.1 80.01,85 80.86,85.85 v83.41,85.85
N$15  (via drill 0.3)
  Top 0.305: S3.B2 23.63,31.7 60.41,31.7 67.51,38.8 67.51,76.6 68.61,77.7 68.61,79.6 69.41,80.4 v73.31,80.4
  Bottom 0.254: U$1.13 73.81,79.89 v73.31,80.4
N$16  (via drill 0.3)
  Top 0.305: S5.B2 68.21,35.92 68.21,75.5 v68.41,75.7
  Bottom 0.254: U$1.4 68.69,75.98 v68.41,75.7
N$18  (via drill 0.3)
  Top 0.305: S6.B2 69.93,43.28 69.01,44.2 v69.01,74.9
  Bottom 0.254: U$1.3 69.49,75.48 v69.01,74.9
N$22
  Top 0.254: U$4.D_IN 75.5,118.9 75.3,118.9 74.69,118.29 74.69,116.26 75.3,115.65 77.53,115.65 78.55,116.66 78.55,138.2 77.02,139.73 U$2.D_OUT
N$23
  Top 0.254: U$4.C_IN 75.7,118.09 76.52,117.27 76.52,116.46 76.92,116.06 77.33,116.06 78.14,116.87 78.14,137.8 77.02,138.92 U$2.CL_OUT
N$24
  Top 0.254: U$5.C_IN 69.2,128.25 69,128.25 68.59,128.65 68.59,129.26 69.41,130.08 71.23,130.08 77.74,123.57 77.74,118.49 77.53,118.29 77.13,118.29 U$4.CL_OUT
N$25
  Top 0.254: U$5.D_IN 69.41,129.06 69.81,129.06 70.42,129.67 71.03,129.67 76.92,123.78 76.92,118.9 U$4.D_OUT
N$26  (via drill 0.3)
  Top 0.254: v67.78,94.92 67.58,94.92 67.17,94.52 U$6.D_IN | v67.78,117.68 67.78,122.76 71.44,126.42 71.44,128.45 70.83,129.06 U$5.D_OUT
  Bottom 0.254: v67.78,117.68 v67.78,94.92
N$27  (via drill 0.3)
  Top 0.254: v66.15,93.7 66.97,93.7 U$6.C_IN | v66.15,117.48 66.15,122.76 70.01,126.62 70.01,127.64 70.62,128.25 U$5.CL_OUT
  Bottom 0.254: v66.15,117.48 v66.15,93.7
N$28
  Top 0.254: U$7.C_IN 54.57,62.41 54.17,62.82 54.17,71.35 65.54,82.73 65.54,94.11 66.97,95.53 68.59,95.53 69.2,94.92 69.2,94.11 68.59,93.5 U$6.CL_OUT
N$29
  Top 0.254: U$7.D_IN 54.77,63.22 54.77,71.15 67.78,84.16 67.78,93.91 68.39,94.52 U$6.D_OUT
N$30
  Top 0.254: U$8.D_OUT 41.57,49.81 55.59,49.81 60.67,54.89 U$9.D_IN
N$31
  Top 0.254: U$8.CL_OUT 41.57,49 55.59,49 60.67,54.08 U$9.C_IN
N$32
  Top 0.254: U$10.C_IN 58.23,40.06 58.43,40.06 58.84,40.47 58.84,48.39 63.11,52.66 63.11,53.47 62.5,54.08 U$9.CL_OUT
N$33
  Top 0.254: U$10.D_IN 58.23,40.87 58.23,49.61 61.68,53.06 61.68,54.49 62.19,55 U$9.D_OUT
N$34  (via drill 0.3)
  Top 0.254: v30.8,59.16 31.41,59.16 U$11.D_IN | v59.45,41.48 59.45,41.07 59.65,40.87 U$10.D_OUT
  Bottom 0.254: v30.8,59.16 30.8,57.53 30.59,57.33 30.59,55.5 44.61,41.48 v59.45,41.48
N$35  (via drill 0.3)
  Top 0.254: v30.19,57.94 30.59,58.35 31.41,58.35 U$11.C_IN | v60.46,40.67 59.85,40.06 U$10.CL_OUT
  Bottom 0.254: v30.19,57.94 30.19,55.3 44.82,40.67 v60.46,40.67
N$36
  Top 0.254: U$12.C_IN 29.98,69.12 29.78,69.12 28.97,68.3 28.97,62.82 32.42,59.36 32.42,58.96 33.03,58.35 U$11.CL_OUT
N$37
  Top 0.254: U$12.D_IN 30.19,69.93 30.39,69.93 30.8,69.52 30.8,61.6 33.03,59.36 U$11.D_OUT
N$38
  Top 0.254: U$12.D_OUT 31.61,70.13 31.61,77.24 35.88,81.51 35.88,83.14 35.37,83.65 U$13.D_IN
N$39
  Top 0.254: U$12.CL_OUT 31.61,69.12 31.81,69.12 33.85,67.08 33.85,56.72 33.24,56.11 31,56.11 28.56,58.55 28.56,76.03 34.66,82.12 34.66,82.32 35.06,82.73 U$13.C_IN
N$40
  Top 0.254: U$14.CL_OUT 31.1,81.41 31.31,81.41 31.81,80.9 31.81,79.89 31,79.07 28.56,79.07 27.95,79.68 27.95,86.59 34.05,92.69 34.45,92.69 34.86,92.28 34.86,91.67 34.25,91.06 U$15.C_IN
N$41
  Top 0.254: U$14.D_OUT 31,82.32 30.8,82.32 30.19,81.71 30.19,80.29 29.37,79.48 28.77,79.48 28.36,79.89 28.36,86.39 34.05,92.08 U$15.D_IN
N$42
  Top 0.254: U$16.D_IN 10.68,82.93 11.29,82.93 28.77,100.41 36.69,100.41 36.89,100.21 36.89,93.3 35.67,92.08 U$15.D_OUT
N$43
  Top 0.254: U$16.C_IN 10.68,81.92 11.29,81.31 11.29,75.21 30.8,55.7 33.44,55.7 37.91,60.18 37.91,89.03 35.67,91.27 U$15.CL_OUT
N$44
  Top 0.254: U$16.CL_OUT 12.1,82.12 19.21,82.12 36.08,98.99 U$17.C_IN
N$45
  Top 0.254: U$16.D_OUT 12.1,82.93 19.21,82.93 36.08,99.8 U$17.D_IN
N$46
  Top 0.254: U$18.D_IN 52.34,93.5 44.21,93.5 37.91,99.8 U$17.D_OUT
N$47
  Top 0.254: U$18.C_IN 52.34,92.69 44.21,92.69 37.91,98.99 U$17.CL_OUT
N$48
  Top 0.254: U$19.C_IN 43.6,108.13 42.79,107.32 42.79,104.07 53.15,93.7 53.15,93.09 53.76,92.48 U$18.CL_OUT
N$49
  Top 0.254: U$19.D_IN 43.8,108.94 44.01,108.94 44.61,108.33 44.61,102.85 53.96,93.5 U$18.D_OUT
N$50
  Top 0.254: U$33.CL_OUT 72.25,137.8 74.08,137.8 75.2,138.92 U$2.C_IN
N$51
  Top 0.254: U$33.D_OUT 72.25,138.61 74.08,138.61 75.2,139.73 U$2.D_IN
N$52
  Top 0.254: U$20.D_OUT 13.93,110.77 13.93,129.87 16.17,132.11 16.17,133.94 15.76,134.35 U$21.D_IN
N$53
  Top 0.254: U$20.CL_OUT 13.73,109.96 13.53,109.96 13.12,110.37 13.12,131.29 15.35,133.53 U$21.C_IN
N$66
  Top 0.254: U$22.D_IN 50.51,118.29 33.24,118.29 17.18,134.34 U$21.D_OUT
N$67
  Top 0.254: U$22.C_IN 50.51,117.48 33.24,117.48 17.18,133.53 U$21.CL_OUT
N$80
  Top 0.254: U$22.D_OUT 52.13,118.29 52.74,118.29 58.74,124.29 U$23.D_IN
N$81
  Top 0.254: U$22.CL_OUT 52.13,117.48 52.95,117.48 58.84,123.37 U$23.C_IN
N$94
  Top 0.254: U$23.D_OUT 60.26,124.39 60.25,124.39 59.24,125.4 52.74,125.4 52.34,125.81 52.34,127.64 51.73,128.25 U$24.D_IN
N$95
  Top 0.254: U$23.CL_OUT 60.26,123.37 59.65,122.76 59.65,121.75 53.15,115.24 51.93,115.24 51.32,115.85 51.32,124.79 50.51,125.61 50.51,126.42 51.52,127.43 U$24.C_IN
N$108
  Top 0.254: U$24.D_OUT 53.15,128.25 53.76,128.25 60.26,134.75 U$25.D_IN
N$109
  Top 0.254: U$24.CL_OUT 53.15,127.43 53.76,127.43 60.26,133.94 U$25.C_IN
N$122
  Top 0.254: U$8.D_IN 40.14,49.81 40.75,49.81 51.12,60.18 54.57,60.18 55.59,61.19 55.59,62.82 55.99,63.22 56.2,63.22 U$7.D_OUT
N$123
  Top 0.254: U$8.C_IN 40.14,48.8 40.35,48.8 40.75,48.39 40.75,47.37 50.3,37.82 59.85,37.82 63.51,41.48 63.51,55.3 56.4,62.41 U$7.CL_OUT
N$124
  Top 0.254: U$14.D_IN 29.58,82.32 29.98,82.32 32.02,84.36 36.08,84.36 36.69,83.75 U$13.D_OUT
N$125
  Top 0.254: U$14.C_IN 29.37,81.51 28.97,81.92 28.97,82.73 31,84.76 36.69,84.76 37.5,83.95 37.5,83.34 36.89,82.73 U$13.CL_OUT
N$126
  Top 0.254: U$19.D_OUT 45.22,109.15 44.61,109.15 44.21,109.55 15.76,109.55 13.93,107.72 11.7,107.72 10.88,108.54 10.88,109.55 12,110.67 12.41,110.67 U$20.D_IN
N$127  (via drill 0.3)
  Top 0.254: v46.04,108.33 45.43,108.33 U$19.CL_OUT | v11.49,109.15 12.31,109.96 U$20.C_IN
  Bottom 0.254: v46.04,108.33 14.95,108.33 14.13,109.15 v11.49,109.15
RST  (via drill 0.3)
  Top 0.254: SWD.2 77.75,94.19 v76.91,93.35
  Top 0.305: S7.B2 78.08,26.78 82.91,31.6 82.91,60.6 81.41,62.1 70.51,62.1 69.81,62.8 69.81,78.3 70.21,78.7 74.61,78.7 75.7,79.79 v75.72,79.79
  Bottom 0.254: U$1.16 75.31,79.38 v75.72,79.79 | v76.91,93.35 76.95,93.31 C5.2
  Bottom 0.406: C5.2 R1.1 76.95,81.02 v75.72,79.79
SCK
  Bottom 0.254: U$1.5 65.22,76.48 64.81,76.9 64.81,83 64.25,83.56 64.25,83.6 | 64.25,83.6 R9.1 | R25.1 64.31,83.66 64.25,83.6
UART0_RXD
  Bottom 0.254: U$1.10 72.31,80.19 72.01,80.5 72.01,96.8 77.61,102.4 77.61,105 80.88,108.27 UART.3
UART0_TXD
  Bottom 0.254: 71.75,78.72 U$1.9 71.81,79.89 71.51,80.2 71.51,97 77.11,102.6 77.11,105.2 82.72,110.81 UART.2
USB_D+
  Bottom 0.254: U$1.23 79.27,74.98 R3.1
USB_D-
  Bottom 0.254: U$1.22 78.97,75.48 R2.1
USB_OTG_ID
  Bottom 0.254: U$1.24 78.31,74.48 78.76,74.03 80.96,74.03 81.35,74.42 J1.4 84.83,74.4
USB_VBUS
  Bottom 0.254: U$1.21 78.31,75.98 79.36,77.03 R4.1
V_USB  (via drill 0.3)
  Top 0.61: v80.91,71.5 80.91,76.73 v81.22,77.05
  Bottom 0.254: 80.32,77.07 R4.2 | 84.83,76.46 J1.1 85.05,76.46 85.51,76.46
  Bottom 0.406: J1.1 81.9,76.37 v81.22,77.05
  Bottom 0.508: R4.2 80.41,77.03 v81.22,77.05
  Bottom 0.61: v80.91,71.5 82.31,70.1 87.31,70.1 88.11,69.3 88.09,69.28 D2.+

### Text on the board
tPlace: UP | B | L | R | A | DOWN | Reset
bPlace: GND | TX | RX | 3v3 | 3v3 | IO | CLK | RST | GND